# Altium project APC1_Sensors.PrjPcb
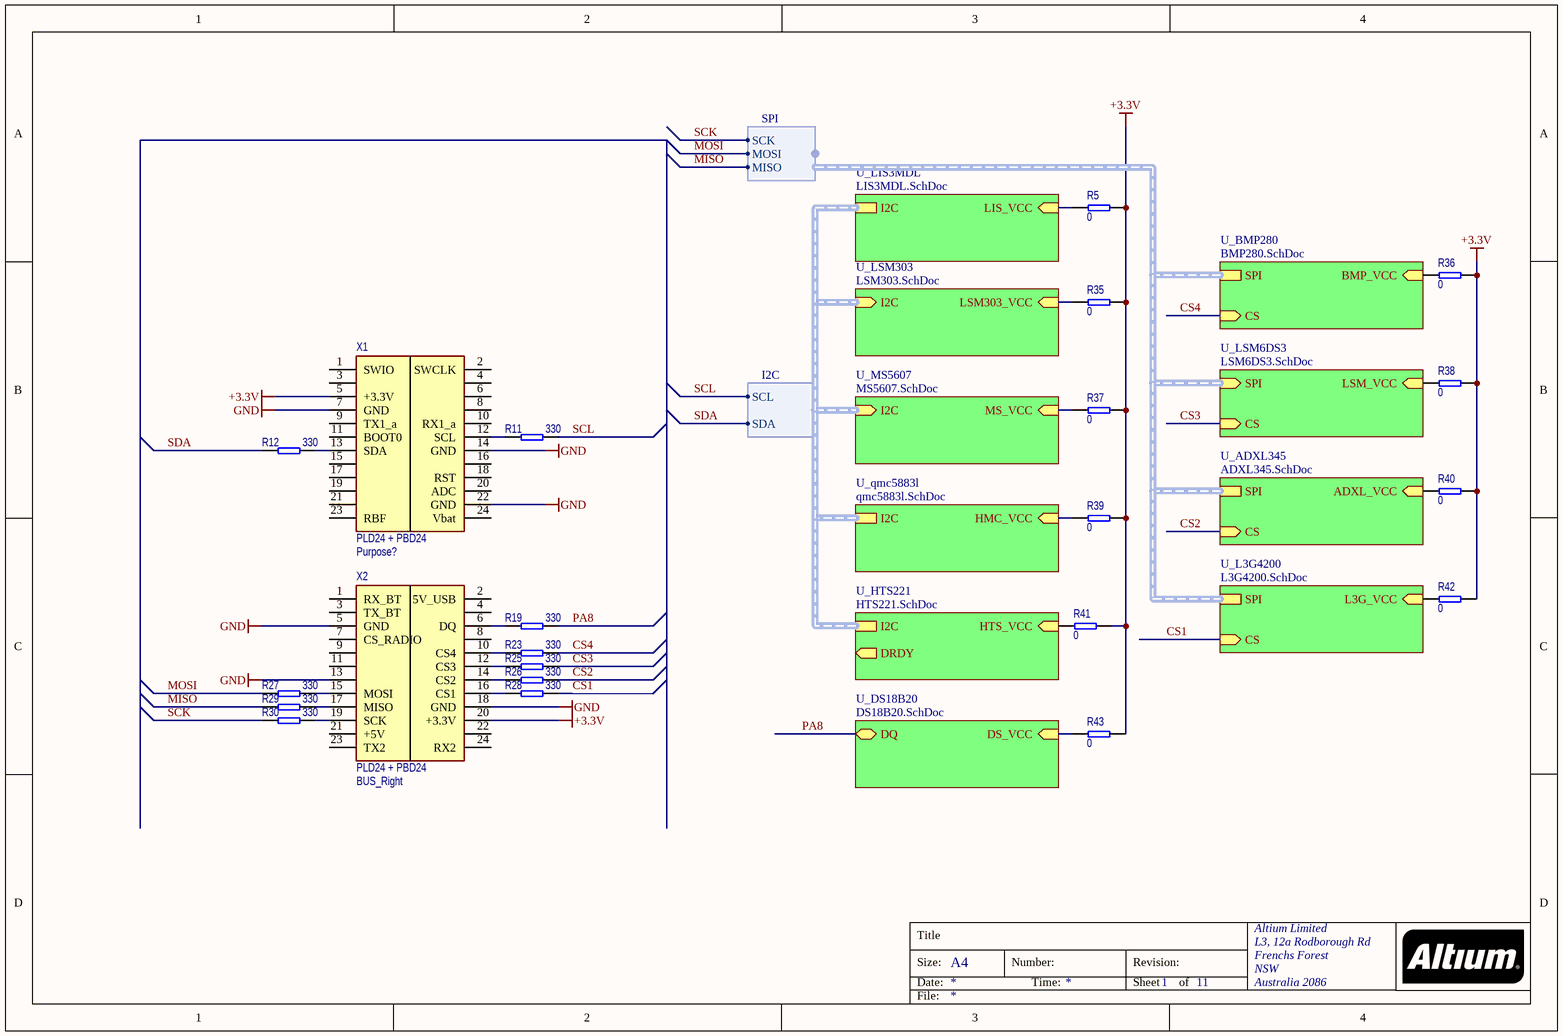
[diagram p0: APC1_Sensors.SchDoc]
11 sheets, 57 parts. Net scope: hierarchical (ports join the sheet entries above them; power ports are global).
Board file: APC1_Sensors.PcbDoc
Sheets:
  APC1_Sensors.SchDoc
    U_BMP280 = BMP280.SchDoc
    U_DS18B20 = DS18B20.SchDoc
    U_LSM6DS3 = LSM6DS3.SchDoc
    U_LSM303 = LSM303.SchDoc
    U_MS5607 = MS5607.SchDoc
    U_qmc5883l = qmc5883l.SchDoc
    U_HTS221 = HTS221.SchDoc
    U_ADXL345 = ADXL345.SchDoc
    U_L3G4200 = L3G4200.SchDoc
    U_LIS3MDL = LIS3MDL.SchDoc

## Sheet APC1_Sensors.SchDoc
size A4; Organization: Altium Limited; Address1: L3, 12a Rodborough Rd; Address2: Frenchs Forest; Address3: NSW; Address4: Australia 2086; SheetNumber: 1; SheetTotal: 11

### Parts
R5  value 0  [RES 0603]
R11  value 330  [RES 0402]
R12  value 330  [RES 0402]
R19  value 330  [RES 0402]
R23  value 330  [RES 0402]
R25  value 330  [RES 0402]
R26  value 330  [RES 0402]
R27  value 330  [RES 0402]
R28  value 330  [RES 0402]
R29  value 330  [RES 0402]
R30  value 330  [RES 0402]
R35  value 0  [RES 0603]
R36  value 0  [RES 0603]
R37  value 0  [RES 0603]
R38  value 0  [RES 0603]
R39  value 0  [RES 0603]
R40  value 0  [RES 0603]
R41  value 0  [RES 0603]
R42  value 0  [RES 0603]
R43  value 0  [RES 0603]
X1  PLD24 + PBD24  Purpose: Purpose?  [PICOSAT_CNN]
X2  PLD24 + PBD24  Purpose: BUS_Right  [PICOSAT_CNN]

### Sub-sheets
U_ADXL345 = ADXL345.SchDoc: CS (in), ADXL_VCC (in), SPI (harness SPI)
U_BMP280 = BMP280.SchDoc: CS (in), BMP_VCC (in), SPI (harness SPI)
U_DS18B20 = DS18B20.SchDoc: DQ (bidir), DS_VCC (in)
U_HTS221 = HTS221.SchDoc: HTS_VCC (in), DRDY (out), I2C (harness I2C)
U_L3G4200 = L3G4200.SchDoc: CS (in), L3G_VCC (in), SPI (harness SPI)
U_LIS3MDL = LIS3MDL.SchDoc: LIS_VCC (in), I2C (harness I2C)
U_LSM6DS3 = LSM6DS3.SchDoc: CS (in), LSM_VCC (in), SPI (in, harness SPI)
U_LSM303 = LSM303.SchDoc: LSM303_VCC (in), I2C (in, harness I2C)
U_MS5607 = MS5607.SchDoc: I2C (in, harness I2C), MS_VCC (in)
U_qmc5883l = qmc5883l.SchDoc: HMC_VCC (in), I2C (harness I2C)

### Harnesses
I2C: SDA, SCL
SPI: SCK, MOSI, MISO

### Nets
+3.3V: R5.2 R35.2 R36.2 R37.2 R38.2 R39.2 R40.2 R41.2 R42.2 R43.2 X1.5(+3.3V) X2.20(+3.3V)
GND: X1.7(GND) X1.14(GND) X1.22(GND) X2.5(GND) X2.13 X2.18(GND)
HTS_Vcc: R41.1 ; sheet U_HTS221/HTS_VCC
LIS_VCC: R5.1 ; sheet U_LIS3MDL/LIS_VCC
LSM303_VCC: R35.1 ; sheet U_LSM303/LSM303_VCC
ADXL_VCC: R40.1 ; sheet U_ADXL345/ADXL_VCC
BMP_VCC: R36.1 ; sheet U_BMP280/BMP_VCC
CS1: R28.2 ; sheet U_L3G4200/CS
CS2: R26.2 ; sheet U_ADXL345/CS
CS3: R25.2 ; sheet U_LSM6DS3/CS
CS4: R23.2 ; sheet U_BMP280/CS
DS_VCC: R43.1 ; sheet U_DS18B20/DS_VCC
HMC_VCC: R39.1 ; sheet U_qmc5883l/HMC_VCC
L3G_VCC: R42.1 ; sheet U_L3G4200/L3G_VCC
LSM_VCC: R38.1 ; sheet U_LSM6DS3/LSM_VCC
MISO: R29.1 ; harness SPI.MISO
MOSI: R27.1 ; harness SPI.MOSI
MS_VCC: R37.1 ; sheet U_MS5607/MS_VCC
PA8: R19.2 ; sheet U_DS18B20/DQ
SCK: R30.1 ; harness SPI.SCK
SCL: R11.2 ; sheet U_LSM303/I2C.SCL
SDA: R12.1 ; sheet U_LSM303/I2C.SDA
NetR11_1: R11.1 X1.12(SCL)
NetR12_2: R12.2 X1.13(SDA)
NetR19_1: R19.1 X2.6(DQ)
NetR23_1: R23.1 X2.10(CS4)
NetR25_1: R25.1 X2.12(CS3)
NetR26_1: R26.1 X2.14(CS2)
NetR27_2: R27.2 X2.15(MOSI)
NetR28_1: R28.1 X2.16(CS1)
NetR29_2: R29.2 X2.17(MISO)
NetR30_2: R30.2 X2.19(SCK)

Not connected (* = marked no-connect by the designer): X1 1(SWIO) 2(SWCLK) 3 4 6 8 9(TX1_a) 10(RX1_a) 11(BOOT0) 15 16 17 18(RST) 19 20(ADC) 21 23(RBF) 24(Vbat); X2 1(RX_BT) 2(5V_USB) 3(TX_BT) 4 7(CS_RADIO) 8 9 11 21(+5V) 22 23(TX2) 24(RX2)

### Buses and harness runs
harness sheet U_ADXL345/SPI = sheet U_BMP280/SPI = sheet U_L3G4200/SPI = sheet U_LSM6DS3/SPI
harness sheet U_HTS221/I2C = sheet U_LIS3MDL/I2C = sheet U_LSM303/I2C = sheet U_MS5607/I2C = sheet U_qmc5883l/I2C

### Notes on the sheet
- Title
- Size:
- Date:
- A4
- Number:
- Time:
- Revision:
- Sheet
- of
- File:

### Library data of the parts
R5 R11 R12 R19 R23 R25-R30 R35-R43 = !Resistor: Resistor; IsSMT: NoSMT
X1 X2 = Header 2x12: 10x2 header; IsSMT: NoSMT

## Sheet BMP280.SchDoc: =GlobalProjectName
size A4; ApprovedBy: Утвердил; CheckedBy: Проверил; Author: Разработал; SheetNumber: 2; SheetTotal: 10; PageSetup: Record=PageOptions|CenterHorizontal=True|CenterVertical=True|PrintScale=1.00|XCorrection=1.00|YCorrection=1.00|PrintKind=1|BorderSize=5000000|LeftOffset=0|BottomOffset=0|Orientation=2|PaperLength=1000|PaperWidth=1000|Scale=100|PaperSource=15|PrintQuality=1200|MediaType=1|DitherType=10|PaperKind=A3|PrintScaleMode=1; Weight: -; ScaleFactor: -; NormInspection: Норм.Контр.
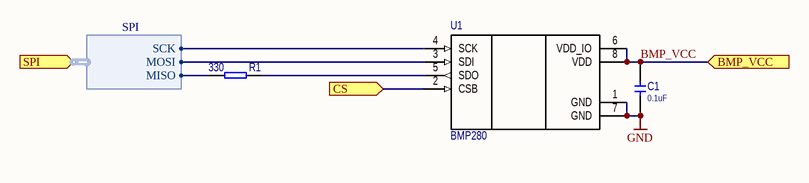
[diagram p1: BMP280.SchDoc]

### Parts
C1  value 0.1uF  [CERCAP 0402]
R1  value 330  [RES 0402]
U1  BMP280  [LGA8_BMP280]

### Ports
BMP_VCC (in), CS (in), SPI (in, harness SPI)

### Harnesses
SPI: SCK, MOSI, MISO

### Nets
GND: C1.1 U1.1(GND) U1.7(GND)
BMP_VCC: C1.2 U1.6(VDD_IO) U1.8(VDD) ; port BMP_VCC
CS4: U1.2(CSB) ; port CS
NetR1_1: R1.1 ; port SPI.MISO
NetR1_2: R1.2 U1.5(SDO)
NetU1_3: U1.3(SDI) ; port SPI.MOSI
NetU1_4: U1.4(SCK) ; port SPI.SCK

### Notes on the sheet
- Title
- Size:
- Date:
- A4
- Number:
- Time:
- Revision:
- Sheet
- of
- File:

### Library data of the parts
C1 = !Capacitor: Capacitor; IsSMT: NoSMT; Diel: X7R; Voltage: *
R1 = !Resistor: Resistor; IsSMT: NoSMT
U1 = BMP(E)280: Temp/Pres/Hum

## Sheet DS18B20.SchDoc: =GlobalProjectName
size A4; ApprovedBy: Утвердил; CheckedBy: Проверил; Author: Разработал; SheetNumber: 3; SheetTotal: 10; PageSetup: Record=PageOptions|CenterHorizontal=True|CenterVertical=True|PrintScale=1.00|XCorrection=1.00|YCorrection=1.00|PrintKind=1|BorderSize=5000000|LeftOffset=0|BottomOffset=0|Orientation=2|PaperLength=1000|PaperWidth=1000|Scale=100|PaperSource=15|PrintQuality=1200|MediaType=1|DitherType=10|PaperKind=A3|PrintScaleMode=1; Weight: -; ScaleFactor: -; NormInspection: Норм.Контр.
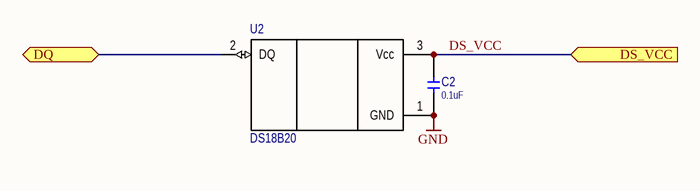
[diagram p2: DS18B20.SchDoc]

### Parts
C2  value 0.1uF  [CERCAP 0402]
U2  DS18B20  [TO-92]

### Ports
DQ (bidir), DS_VCC (in)

### Nets
GND: C2.1 U2.1(GND)
DS_VCC: C2.2 U2.3(Vcc) ; port DS_VCC
PA8: U2.2(DQ) ; port DQ

### Notes on the sheet
- Title
- Size:
- Date:
- A4
- Number:
- Time:
- Revision:
- Sheet
- of
- File:

### Library data of the parts
C2 = !Capacitor: Capacitor; IsSMT: NoSMT; Diel: X7R; Voltage: *
U2 = DS18B20: Temp; IsSMT: NoSMT

## Sheet LSM6DS3.SchDoc: =GlobalProjectName
size A4; ApprovedBy: Утвердил; CheckedBy: Проверил; Author: Разработал; SheetNumber: 4; SheetTotal: 10; PageSetup: Record=PageOptions|CenterHorizontal=True|CenterVertical=True|PrintScale=1.00|XCorrection=1.00|YCorrection=1.00|PrintKind=1|BorderSize=5000000|LeftOffset=0|BottomOffset=0|Orientation=2|PaperLength=1000|PaperWidth=1000|Scale=100|PaperSource=15|PrintQuality=1200|MediaType=1|DitherType=10|PaperKind=A3|PrintScaleMode=1; Weight: -; ScaleFactor: -; NormInspection: Норм.Контр.
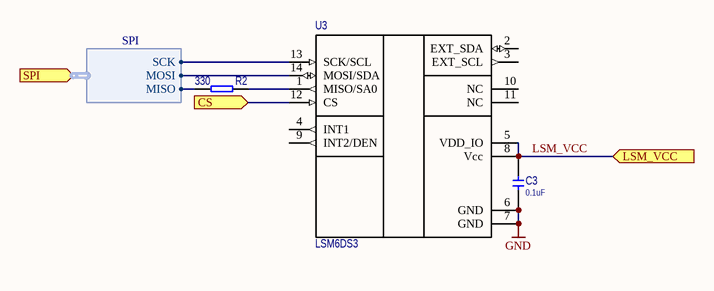
[diagram p3: LSM6DS3.SchDoc]

### Parts
C3  value 0.1uF  [CERCAP 0402]
R2  value 330  [RES 0402]
U3  LSM6DS3  [LGA14_LSM6DS3]

### Ports
CS (in), LSM_VCC (in), SPI (in, harness SPI)

### Harnesses
SPI: SCK, MOSI, MISO

### Nets
GND: C3.1 U3.6(GND) U3.7(GND)
CS3: U3.12(CS) ; port CS
LSM_VCC: C3.2 U3.5(VDD_IO) U3.8(Vcc) ; port LSM_VCC
NetR1_1: R2.1 ; port SPI.MISO
NetR2_2: R2.2 U3.1(MISO/SA0)
NetU1_3: U3.14(MOSI/SDA) ; port SPI.MOSI
NetU1_4: U3.13(SCK/SCL) ; port SPI.SCK

Not connected (* = marked no-connect by the designer): U3 2(EXT_SDA) 3(EXT_SCL) 4(INT1) 9(INT2/DEN) 10(NC) 11(NC)

### Notes on the sheet
- Title
- Size:
- Date:
- A4
- Number:
- Time:
- Revision:
- Sheet
- of
- File:

### Library data of the parts
C3 = !Capacitor: Capacitor; IsSMT: NoSMT; Diel: X7R; Voltage: *
R2 = !Resistor: Resistor; IsSMT: NoSMT
U3 = LSM6DS3: Acc/Gyro; IsSMT: NoSMT

## Sheet LSM303.SchDoc: =GlobalProjectName
size A4; ApprovedBy: Утвердил; CheckedBy: Проверил; Author: Разработал; SheetNumber: 5; SheetTotal: 10; PageSetup: Record=PageOptions|CenterHorizontal=True|CenterVertical=True|PrintScale=1.00|XCorrection=1.00|YCorrection=1.00|PrintKind=1|BorderSize=5000000|LeftOffset=0|BottomOffset=0|Orientation=2|PaperLength=1000|PaperWidth=1000|Scale=100|PaperSource=15|PrintQuality=1200|MediaType=1|DitherType=10|PaperKind=A3|PrintScaleMode=1; Weight: -; ScaleFactor: -; NormInspection: Норм.Контр.
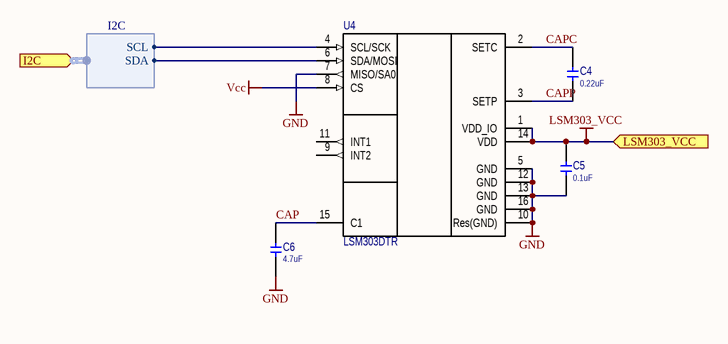
[diagram p4: LSM303.SchDoc]

### Parts
C4  value 0.22uF  [CERCAP 0402]
C5  value 0.1uF  [CERCAP 0402]
C6  value 4.7uF  [CERCAP 0603]
U4  LSM303DTR  [LGA16_LSM303DTR]

### Ports
I2C (in, harness I2C), LSM303_VCC (in)

### Harnesses
I2C: SCL, SDA

### Nets
GND: C5.1 C6.1 U4.5(GND) U4.7(MISO/SA0) U4.10(Res(GND)) U4.12(GND) U4.13(GND) U4.16(GND)
LSM303_VCC: C5.2 U4.1(VDD_IO) U4.14(VDD) ; port LSM303_VCC
Vcc: U4.8(CS)
CAP: C6.2 U4.15(C1)
CAPC: C4.2 U4.2(SETC)
CAPP: C4.1 U4.3(SETP)
SCL: U4.4(SCL/SCK) ; port I2C.SCL
SDA: U4.6(SDA/MOSI) ; port I2C.SDA

Not connected (* = marked no-connect by the designer): U4 9(INT2) 11(INT1)

### Notes on the sheet
- Title
- Size:
- Date:
- A4
- Number:
- Time:
- Revision:
- Sheet
- of
- File:

### Library data of the parts
C4-C6 = !Capacitor: Capacitor; IsSMT: NoSMT; Diel: X7R; Voltage: *
U4 = LSM303DTR: Acc/Mag

## Sheet MS5607.SchDoc
size A4; Organization: Altium Limited; Address1: L3, 12a Rodborough Rd; Address2: Frenchs Forest; Address3: NSW; Address4: Australia 2086; SheetNumber: 7; SheetTotal: 10
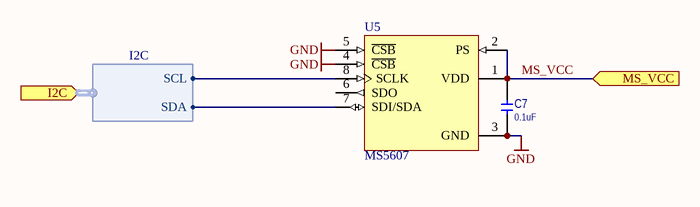
[diagram p5: MS5607.SchDoc]

### Parts
C7  value 0.1uF  [CERCAP 0402]
U5  MS5607  [QFN-8(MS5607)]

### Ports
I2C (in, harness I2C), MS_VCC (in)

### Harnesses
I2C: SDA, SCL

### Nets
GND: C7.1 U5.3(GND) U5.4(~{CSB}) U5.5(~{CSB})
MS_VCC: C7.2 U5.1(VDD) U5.2(PS) ; port MS_VCC
SCL: U5.8(SCLK) ; port I2C.SCL
SDA: U5.7(SDI/SDA) ; port I2C.SDA

Not connected (* = marked no-connect by the designer): U5 6(SDO)

### Notes on the sheet
- Title
- Size:
- Date:
- A4
- Number:
- Time:
- Revision:
- Sheet
- of
- File:

### Library data of the parts
C7 = !Capacitor: Capacitor; IsSMT: NoSMT; Diel: X7R; Voltage: *
U5 = MS5607: Temp/Pres; IsSMT: NoSMT

## Sheet qmc5883l.SchDoc
size A4; Organization: Altium Limited; Address1: L3, 12a Rodborough Rd; Address2: Frenchs Forest; Address3: NSW; Address4: Australia 2086; SheetNumber: 6; SheetTotal: 10
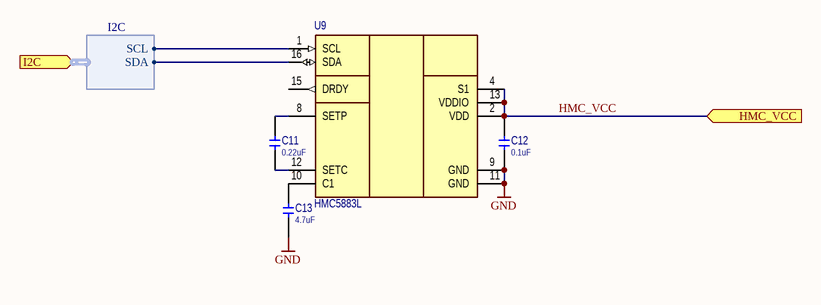
[diagram p6: qmc5883l.SchDoc]

### Parts
C11  value 0.22uF  [CERCAP 0402]
C12  value 0.1uF  [CERCAP 0402]
C13  value 4.7uF  [CERCAP 0603]
U9  HMC5883L  [LGA16_HMC5883L]

### Ports
HMC_VCC (in), I2C (in, harness I2C)

### Harnesses
I2C: SCL, SDA

### Nets
GND: C12.1 C13.1 U9.9(GND) U9.11(GND)
HMC_VCC: C12.2 U9.2(VDD) U9.4(S1) U9.13(VDDIO) ; port HMC_VCC
SCL: U9.1(SCL) ; port I2C.SCL
SDA: U9.16(SDA) ; port I2C.SDA
NetC11_1: C11.1 U9.12(SETC)
NetC11_2: C11.2 U9.8(SETP)
NetC13_2: C13.2 U9.10(C1)

Not connected (* = marked no-connect by the designer): U9 15(DRDY)

### Notes on the sheet
- Title
- Size:
- Date:
- A4
- Number:
- Time:
- Revision:
- Sheet
- of
- File:

### Library data of the parts
C11-C13 = !Capacitor: Capacitor; IsSMT: NoSMT; Diel: X7R; Voltage: *
U9 = Q/HMC5883l: Gyro

## Sheet HTS221.SchDoc
size A4; Organization: Altium Limited; Address1: L3, 12a Rodborough Rd; Address2: Frenchs Forest; Address3: NSW; Address4: Australia 2086; SheetNumber: 8; SheetTotal: 10
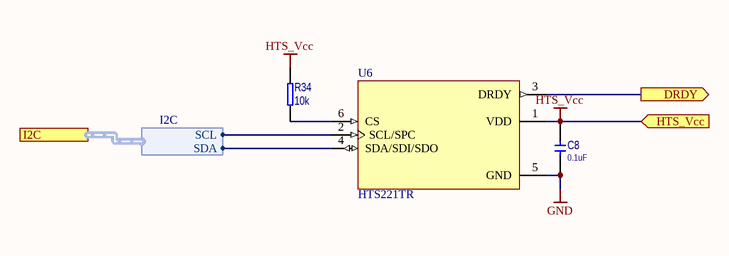
[diagram p7: HTS221.SchDoc]

### Parts
C8  value 0.1uF  [CERCAP 0402]
R34  value 10k  [RES 0402]
U6  HTS221TR  [LGA6_HTS221]

### Ports
DRDY (out), HTS_Vcc (in), I2C (harness I2C)

### Harnesses
I2C: SDA, SCL

### Nets
GND: C8.1 U6.5(GND)
HTS_Vcc: C8.2 R34.2 U6.1(VDD) ; port HTS_Vcc
SCL: U6.2(SCL/SPC) ; port I2C.SCL
SDA: U6.4(SDA/SDI/SDO) ; port I2C.SDA
NetR34_1: R34.1 U6.6(CS)
NetU6_3: U6.3(DRDY) ; port DRDY

### Notes on the sheet
- Title
- Size:
- Date:
- A4
- Number:
- Time:
- Revision:
- Sheet
- of
- File:

### Library data of the parts
C8 = !Capacitor: Capacitor; IsSMT: NoSMT; Diel: X7R; Voltage: *
R34 = !Resistor: Resistor; IsSMT: NoSMT
U6 = HTS221TR: Humidity Temperature Sensor 0 ~ 100% RH IÂ²C, SPI Â±4.5% RH 10s Surface Mount; MF: STMicroelectronics; SnapEDA_Link: https://www.snapeda.com/parts/HTS221TR/STMicroelectronics/view-part/231234/?ref=snap; MP: HTS221TR; Value: *; Digi-Key_Part_Number: 497-15382-1-ND; Digi-Key_Purchase_URL: https://www.digikey.co.za/product-detail/en/stmicroelectronics/HTS221TR/497-15382-1-ND/5180533?utm_source=snapeda&utm_medium=aggregator&utm_campaign=symbol; Package: VFLGA-6 STMicroelectronics; Order: HTS221TR

## Sheet ADXL345.SchDoc
size A4; Organization: Altium Limited; Address1: L3, 12a Rodborough Rd; Address2: Frenchs Forest; Address3: NSW; Address4: Australia 2086; SheetNumber: 9; SheetTotal: 10
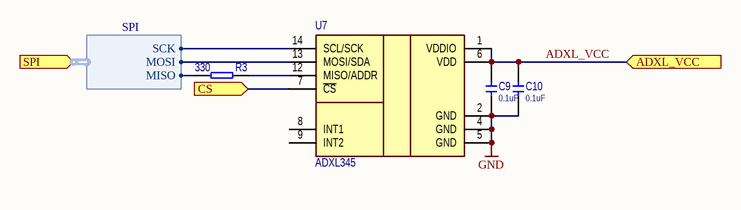
[diagram p8: ADXL345.SchDoc]

### Parts
C9  value 0.1uF  [CERCAP 0402]
C10  value 0.1uF  [CERCAP 0402]
R3  value 330  [RES 0402]
U7  ADXL345  [LGA14_ADXL345]

### Ports
ADXL_VCC (in), CS (in), SPI (in, harness SPI)

### Harnesses
SPI: SCK, MOSI, MISO

### Nets
GND: C9.1 C10.1 U7.2(GND) U7.4(GND) U7.5(GND)
ADXL_VCC: C9.2 C10.2 U7.1(VDDIO) U7.6(VDD) ; port ADXL_VCC
CS2: U7.7(~{CS}) ; port CS
NetR1_1: R3.1 ; port SPI.MISO
NetR3_2: R3.2 U7.12(MISO/ADDR)
NetU1_3: U7.13(MOSI/SDA) ; port SPI.MOSI
NetU1_4: U7.14(SCL/SCK) ; port SPI.SCK

Not connected (* = marked no-connect by the designer): U7 8(INT1) 9(INT2)

### Notes on the sheet
- Title
- Size:
- Date:
- A4
- Number:
- Time:
- Revision:
- Sheet
- of
- File:

### Library data of the parts
C9 C10 = !Capacitor: Capacitor; IsSMT: NoSMT; Diel: X7R; Voltage: *
R3 = !Resistor: Resistor; IsSMT: NoSMT
U7 = ADXL345: Acc

## Sheet L3G4200.SchDoc
size A4; Organization: Altium Limited; Address1: L3, 12a Rodborough Rd; Address2: Frenchs Forest; Address3: NSW; Address4: Australia 2086; SheetNumber: 10; SheetTotal: 10
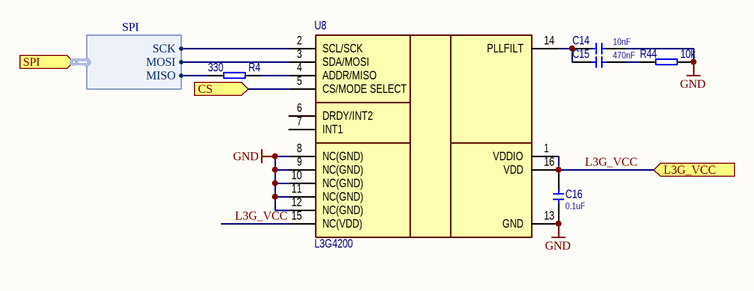
[diagram p9: L3G4200.SchDoc]

### Parts
C14  value 10nF  [CERCAP 0402]
C15  value 470nF  [CERCAP 0402]
C16  value 0.1uF  [CERCAP 0402]
R4  value 330  [RES 0402]
R44  value 10k  [RES 0402]
U8  L3G4200  [LGA16_L3G4200]

### Ports
CS (in), L3G_VCC (in), SPI (in, harness SPI)

### Harnesses
SPI: SCK, MOSI, MISO

### Nets
GND: C14.2 C16.1 R44.2 U8.8(NC(GND)) U8.9(NC(GND)) U8.10(NC(GND)) U8.11(NC(GND)) U8.12(NC(GND)) U8.13(GND)
CS1: U8.5(CS/MODE_SELECT) ; port CS
L3G_VCC: C16.2 U8.1(VDDIO) U8.15(NC(VDD)) U8.16(VDD) ; port L3G_VCC
NetC14_1: C14.1 C15.1 U8.14(PLLFILT)
NetC15_2: C15.2 R44.1
NetR1_1: R4.1 ; port SPI.MISO
NetR4_2: R4.2 U8.4(ADDR/MISO)
NetU1_3: U8.3(SDA/MOSI) ; port SPI.MOSI
NetU1_4: U8.2(SCL/SCK) ; port SPI.SCK

Not connected (* = marked no-connect by the designer): U8 6(DRDY/INT2) 7(INT1)

### Notes on the sheet
- Title
- Size:
- Date:
- A4
- Number:
- Time:
- Revision:
- Sheet
- of
- File:

### Library data of the parts
C14-C16 = !Capacitor: Capacitor; IsSMT: NoSMT; Diel: X7R; Voltage: *
R4 R44 = !Resistor: Resistor; IsSMT: NoSMT

## Sheet LIS3MDL.SchDoc
size A4; SheetNumber: 11; SheetTotal: 11
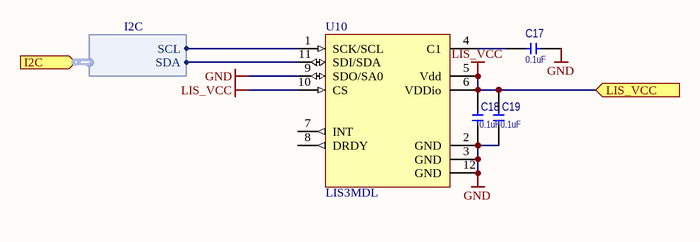
[diagram p10: LIS3MDL.SchDoc]

### Parts
C17  value 0.1uF  [CERCAP 0402]
C18  value 0.1uF  [CERCAP 0402]
C19  value 0.1uF  [CERCAP 0402]
U10  LIS3MDL  [LGA12_LIS3MDL]

### Ports
I2C (in, harness I2C), LIS_VCC (in)

### Harnesses
I2C: SCL, SDA

### Nets
GND: C17.1 C18.1 C19.1 U10.2(GND) U10.3(GND) U10.9(SDO/SA0) U10.12(GND)
LIS_VCC: C18.2 C19.2 U10.5(Vdd) U10.6(VDDio) U10.10(CS) ; port LIS_VCC
SCL: U10.1(SCK/SCL) ; port I2C.SCL
SDA: U10.11(SDI/SDA) ; port I2C.SDA
NetC17_2: C17.2 U10.4(C1)

Not connected (* = marked no-connect by the designer): U10 7(INT) 8(DRDY)

### Library data of the parts
C17-C19 = !Capacitor: Capacitor; IsSMT: NoSMT; Diel: X7R; Voltage: *
U10 = LIS3MDL: Mag; IsSMT: NoSMT

## Nets that join several sheets
GND: APC1_Sensors (6 pins), BMP280 (C1.1 U1.1 U1.7), DS18B20 (C2.1 U2.1), LSM6DS3 (C3.1 U3.6 U3.7), LSM303 (8 pins), MS5607 (C7.1 U5.3 U5.4 U5.5), qmc5883l (C12.1 C13.1 U9.9 U9.11), HTS221 (C8.1 U6.5), ADXL345 (5 pins), L3G4200 (9 pins), LIS3MDL (7 pins)
HTS_Vcc: APC1_Sensors (R41.1), HTS221 (C8.2 R34.2 U6.1)
LIS_VCC: APC1_Sensors (R5.1), LIS3MDL (5 pins)
LSM303_VCC: APC1_Sensors (R35.1), LSM303 (C5.2 U4.1 U4.14)
ADXL_VCC: APC1_Sensors (R40.1), ADXL345 (C9.2 C10.2 U7.1 U7.6)
BMP_VCC: APC1_Sensors (R36.1), BMP280 (C1.2 U1.6 U1.8)
CS1: APC1_Sensors (R28.2), L3G4200 (U8.5)
CS2: APC1_Sensors (R26.2), ADXL345 (U7.7)
CS3: APC1_Sensors (R25.2), LSM6DS3 (U3.12)
CS4: APC1_Sensors (R23.2), BMP280 (U1.2)
DS_VCC: APC1_Sensors (R43.1), DS18B20 (C2.2 U2.3)
HMC_VCC: APC1_Sensors (R39.1), qmc5883l (C12.2 U9.2 U9.4 U9.13)
L3G_VCC: APC1_Sensors (R42.1), L3G4200 (C16.2 U8.1 U8.15 U8.16)
LSM_VCC: APC1_Sensors (R38.1), LSM6DS3 (C3.2 U3.5 U3.8)
MS_VCC: APC1_Sensors (R37.1), MS5607 (C7.2 U5.1 U5.2)
NetR1_1: BMP280 (R1.1), LSM6DS3 (R2.1), ADXL345 (R3.1), L3G4200 (R4.1)
NetU1_3: BMP280 (U1.3), LSM6DS3 (U3.14), ADXL345 (U7.13), L3G4200 (U8.3)
NetU1_4: BMP280 (U1.4), LSM6DS3 (U3.13), ADXL345 (U7.14), L3G4200 (U8.2)
PA8: APC1_Sensors (R19.2), DS18B20 (U2.2)
SCL: APC1_Sensors (R11.2), LSM303 (U4.4), MS5607 (U5.8), qmc5883l (U9.1), HTS221 (U6.2), LIS3MDL (U10.1)
SDA: APC1_Sensors (R12.1), LSM303 (U4.6), MS5607 (U5.7), qmc5883l (U9.16), HTS221 (U6.4), LIS3MDL (U10.11)